# EAGLE schematic STM32F303CBT6_BTN8962TA_V1_0 (EAGLE 7.7.0)
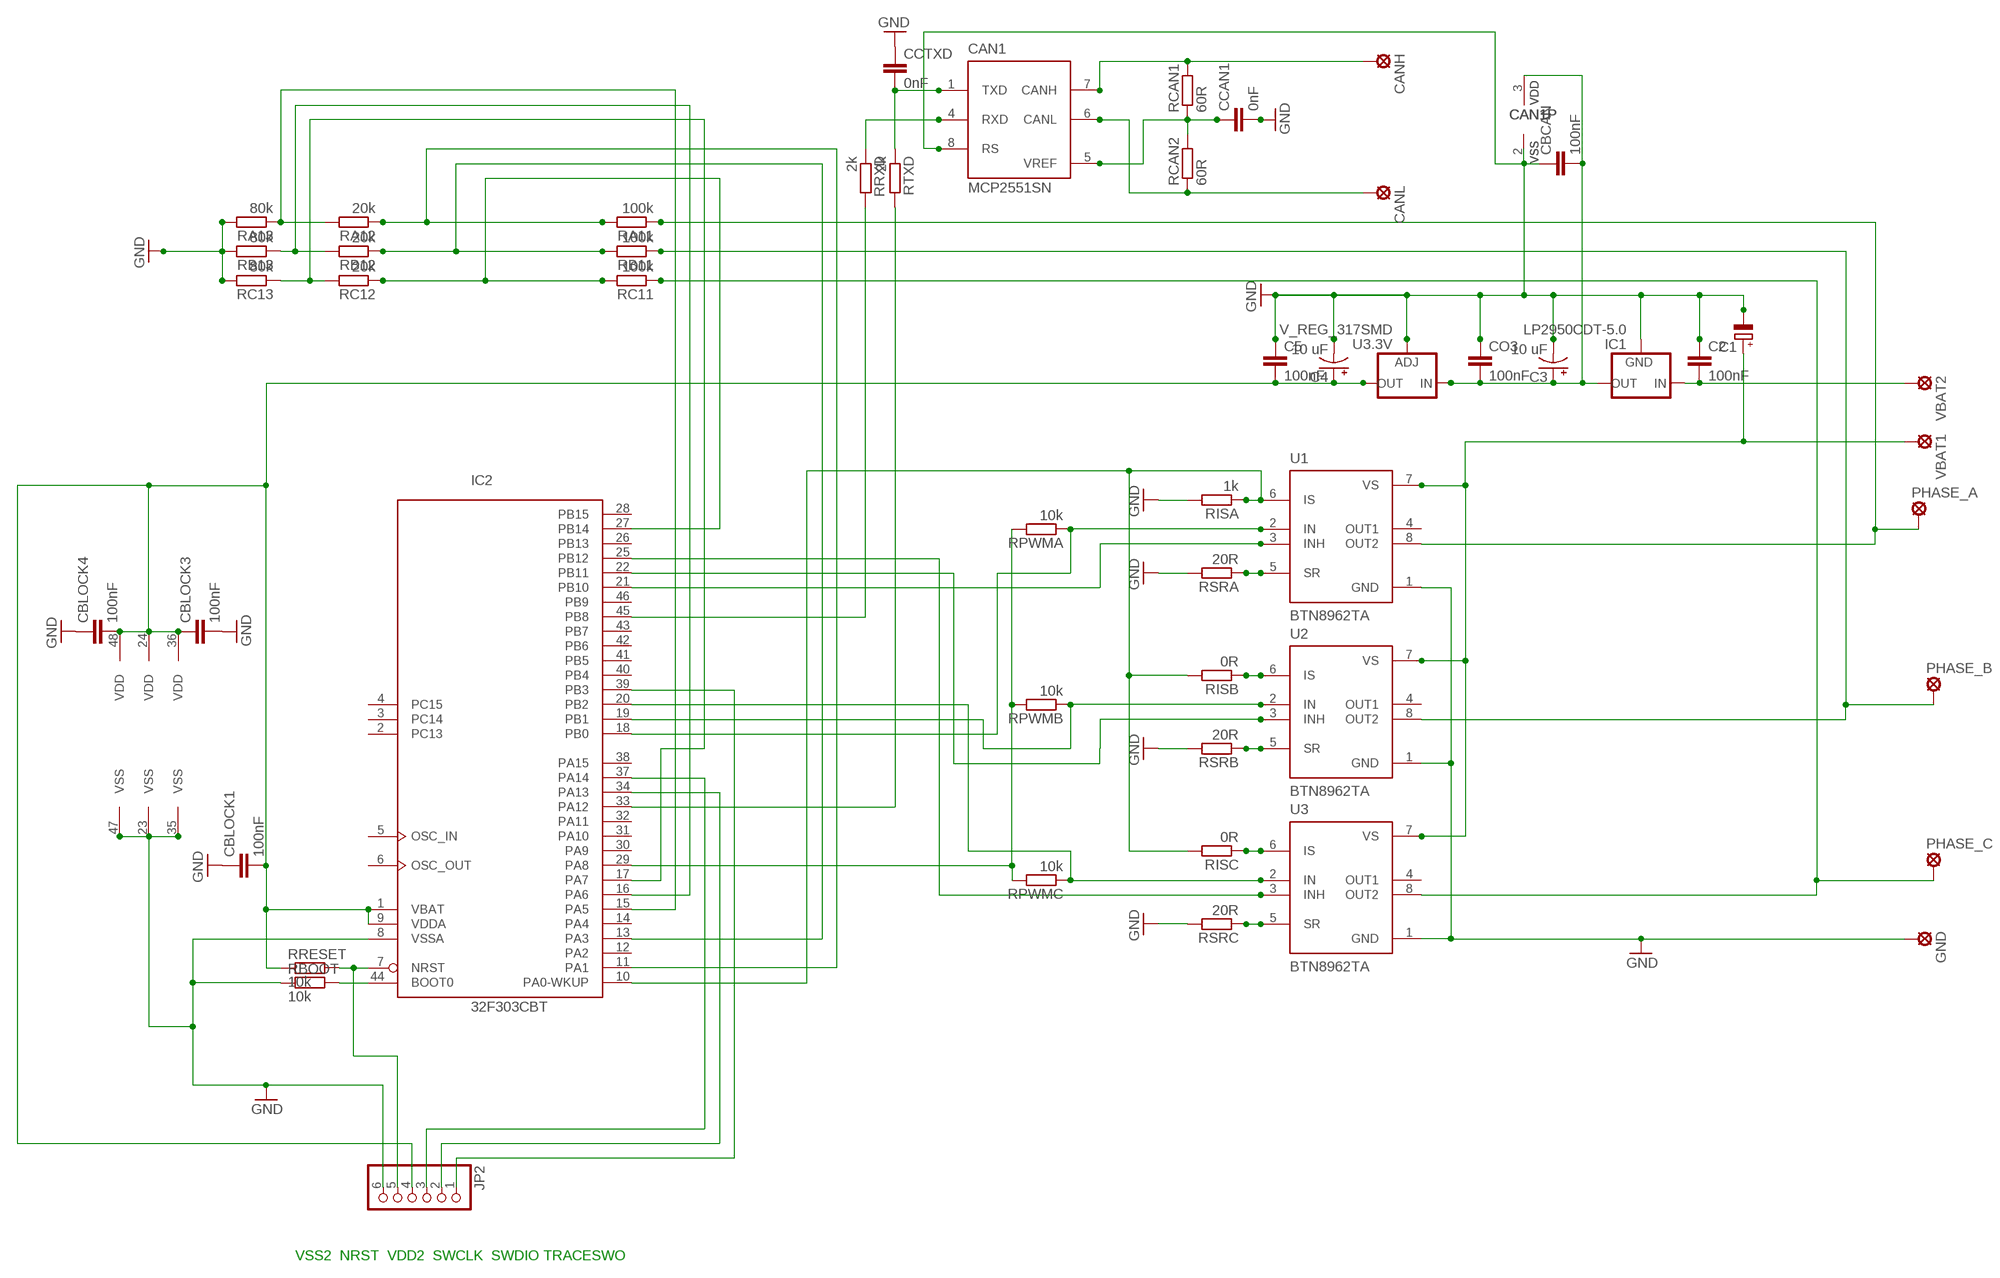
[diagram p0: schematic, sheet 1]

## Parts
C1  CPOL-EUE3.5-10  [E3,5-10]
C2  100nF  C-EUC0805  [C0805]
C3  10 uF  CAP_POLD  [PANASONIC_D]
C4  10 uF  CAP_POLD  [PANASONIC_D]
C5  100nF  C-EUC0805  [C0805]
CAN1  MCP2551SN  [SO-08]
CANH  LSP10  [LSP10]
CANL  LSP10  [LSP10]
CBCAN  100nF  C-EUC0805  [C0805]
CBLOCK1  100nF  C-EUC0805  [C0805]
CBLOCK3  100nF  C-EUC0805  [C0805]
CBLOCK4  100nF  C-EUC0805  [C0805]
CCAN1  0nF  C-EUC0805  [C0805]
CCTXD  0nF  C-EUC0805  [C0805]
CO3  100nF  C-EUC0805  [C0805]
GND  SE14  [SE14]
IC1  LP2950CDT-5.0  [DPACK]
IC2  32F303CBT  STM32F303CBT  [LQFP48]
JP2  PINHD-1X6  [1X06]
PHASE_A  SE14  [SE14]
PHASE_B  SE14  [SE14]
PHASE_C  SE14  [SE14]
RA11  100k  R-EU_R0805  [R0805]
RA12  20k  R-EU_R0805  [R0805]
RA13  80k  R-EU_R0805  [R0805]
RB11  100k  R-EU_R0805  [R0805]
RB12  20k  R-EU_R0805  [R0805]
RB13  80k  R-EU_R0805  [R0805]
RBOOT  10k  R-EU_R0805  [R0805]
RC11  100k  R-EU_R0805  [R0805]
RC12  20k  R-EU_R0805  [R0805]
RC13  80k  R-EU_R0805  [R0805]
RCAN1  60R  R-EU_R0805  [R0805]
RCAN2  60R  R-EU_R0805  [R0805]
RISA  1k  R-EU_R0805  [R0805]
RISB  0R  R-EU_R0805  [R0805]
RISC  0R  R-EU_R0805  [R0805]
RPWMA  10k  R-EU_R0805  [R0805]
RPWMB  10k  R-EU_R0805  [R0805]
RPWMC  10k  R-EU_R0805  [R0805]
RRESET  10k  R-EU_R0805  [R0805]
RRXD  2k  R-EU_R0805  [R0805]
RSRA  20R  R-EU_R0805  [R0805]
RSRB  20R  R-EU_R0805  [R0805]
RSRC  20R  R-EU_R0805  [R0805]
RTXD  2k  R-EU_R0805  [R0805]
U1  BTN8962TA  [TO127P1500X440-8N-1]
U2  BTN8962TA  [TO127P1500X440-8N-1]
U3  BTN8962TA  [TO127P1500X440-8N-1]
U3.3V  V_REG_317SMD  [SOT223]
VBAT1  SE14  [SE14]
VBAT2  SE14  [SE14]

## Nets
A: IC2.11(PA1) RA11.2 RA12.1
B: IC2.13(PA3) RB11.2 RB12.1
C: IC2.27(PB14) RC11.2 RC12.1
GND: C1.- C2.1 C3.- C4.- C5.1 CAN1.2(VSS) CAN1.8(RS) CBCAN.1 CBLOCK1.1 CBLOCK3.2 CBLOCK4.1 CCAN1.2 CCTXD.1 CO3.1 GND.MP IC1.4(GND) IC2.8(VSSA) IC2.23(VSS) IC2.35(VSS) IC2.47(VSS) JP2.6 RA13.2 RB13.2 RBOOT.1 RC13.2 RISA.2 RSRA.2 RSRB.2 RSRC.2 U1.1(GND) U2.1(GND) U3.1(GND) U3.3V.1(ADJ)
N$1: PHASE_A.MP RA11.1 U1.8(OUT2)
N$2: PHASE_B.MP RB11.1 U2.8(OUT2)
N$3: PHASE_C.MP RC11.1 U3.8(OUT2)
N$4: C1.+ U1.7(VS) U2.7(VS) U3.7(VS) VBAT1.MP
N$5: IC2.45(PB8) RRXD.2
N$6: RSRA.1 U1.5(SR)
N$7: RISB.1 U2.6(IS)
N$8: RSRB.1 U2.5(SR)
N$9: RISC.1 U3.6(IS)
N$10: IC2.10(PA0-WKUP) RISA.1 RISB.2 RISC.2 U1.6(IS)
N$11: RSRC.1 U3.5(SR)
N$15: IC2.39(PB3) JP2.1
N$17: IC2.19(PB1) RPWMB.1 U2.2(IN)
N$18: IC2.20(PB2) RPWMC.1 U3.2(IN)
N$19: IC2.25(PB12) U3.3(INH)
N$20: IC2.29(PA8) RPWMA.2 RPWMB.2 RPWMC.2
N$21: IC2.22(PB11) U2.3(INH)
N$22: IC2.21(PB10) U1.3(INH)
N$23: IC2.18(PB0) RPWMA.1 U1.2(IN)
N$27: IC2.34(PA13) JP2.2
N$28: IC2.37(PA14) JP2.3
N$32: IC2.33(PA12) RTXD.2
N$33: CAN1.4(RXD) RRXD.1
N$34: CAN1.6(CANL) CANL.MP RCAN2.1
N$36: CAN1.1(TXD) CCTXD.2 RTXD.1
N$37: CAN1.5(VREF) CCAN1.1 RCAN1.1 RCAN2.2
N$38: IC2.44(BOOT0) RBOOT.2
N$39: C2.2 IC1.1(IN) VBAT2.MP
N$40: CAN1.7(CANH) CANH.MP RCAN1.2
N$42: IC2.17(PA7) RC12.2 RC13.1
N$43: IC2.16(PA6) RB12.2 RB13.1
N$45: IC2.15(PA5) RA12.2 RA13.1
N$54: IC2.7(NRST) JP2.5 RRESET.2
V50: C3.+ CAN1.3(VDD) CBCAN.2 CO3.2 IC1.3(OUT) U3.3V.3(IN)
VDD: C4.+ C5.2 CBLOCK1.2 CBLOCK3.1 CBLOCK4.2 IC2.1(VBAT) IC2.9(VDDA) IC2.24(VDD) IC2.36(VDD) IC2.48(VDD) JP2.4 RRESET.1 U3.3V.2(OUT)
Unconnected: IC2.2(PC13) IC2.3(PC14) IC2.4(PC15) IC2.5(OSC_IN) IC2.6(OSC_OUT) IC2.12(PA2) IC2.14(PA4) IC2.26(PB13) IC2.28(PB15) IC2.30(PA9) IC2.31(PA10) IC2.32(PA11) IC2.38(PA15) IC2.40(PB4) IC2.41(PB5) IC2.42(PB6) IC2.43(PB7) IC2.46(PB9) U1.4(OUT1) U2.4(OUT1) U3.4(OUT1)

## Notes on the sheet
- VSS2  NRST  VDD2  SWCLK  SWDIO TRACESWO

## Library data of the parts
C1 = rcl:CPOL-EU: POLARIZED CAPACITOR, European symbol
C2 C5 CBCAN CBLOCK1 CBLOCK3 CBLOCK4 CCAN1 CCTXD CO3 = rcl:C-EU: CAPACITOR, European symbol
C3 C4 = SparkFun-Capacitors:CAP_POL: Capacitor Polarized These are standard SMD and PTH capacitors. Normally 10uF, 47uF, and 100uF in electrolytic and tantalum varieties. Always verify the external diameter of the through hole cap, it varies with capacity, voltage, and manufacturer. The EIA devices should be standard.
CAN1 = microchip_can:MCP2551: High Speed CAN tranceiver
CANH CANL = solpad:LSP10: SOLDER PAD drill 1.0 mm, distributor Buerklin, 12H555
GND PHASE_A PHASE_B PHASE_C VBAT1 VBAT2 = solpad:SE14: SOLDER PAD E1553, drill 1,4mm, distributor Buerklin, 07F820
IC1 = v-reg:LP2950?*: Source: http://cache.national.com/ds/LP/LP2950.pdf
IC2 = micro-stm_v2:STM32F303C*T: ARM 32-bit Cortex™-M3 CPU 72 MHz maximum frequency 128 to 256 Kbytes of Flash memory 32 to 40 kbytes of SRAM 37 GPIOs 2.0 to 3.6 V application supply
JP2 = adafruit:PINHD-1X6: PIN HEADER
RA11-RA13 RB11-RB13 RBOOT RC11-RC13 RCAN1 RCAN2 RISA RISB RISC RPWMA RPWMB RPWMC RRESET RRXD RSRA RSRB RSRC RTXD = rcl:R-EU_: RESISTOR, European symbol
U1-U3 = BTN8962TA:BTN8962TA: BTN8962TA High Current PN Half Bridge NovalithIC TO127P1500X440-8N-1
U3.3V = SparkFun-PowerIC:V_REG_317: Voltage Regulator Standard LM317 adjustable voltage regulator. AOI (Adjust Output Input). Google 'LM317 Calculator' for easy to use app to get the two resistor values needed. 240/720 for 5V output. 240/390 for 3.3V output. Spark Fun Electronics SKU : COM-00527

## Net classes
0 default: clearance 0.205 mm